# EAGLE design Bat_Node (EAGLE 9.6.0)
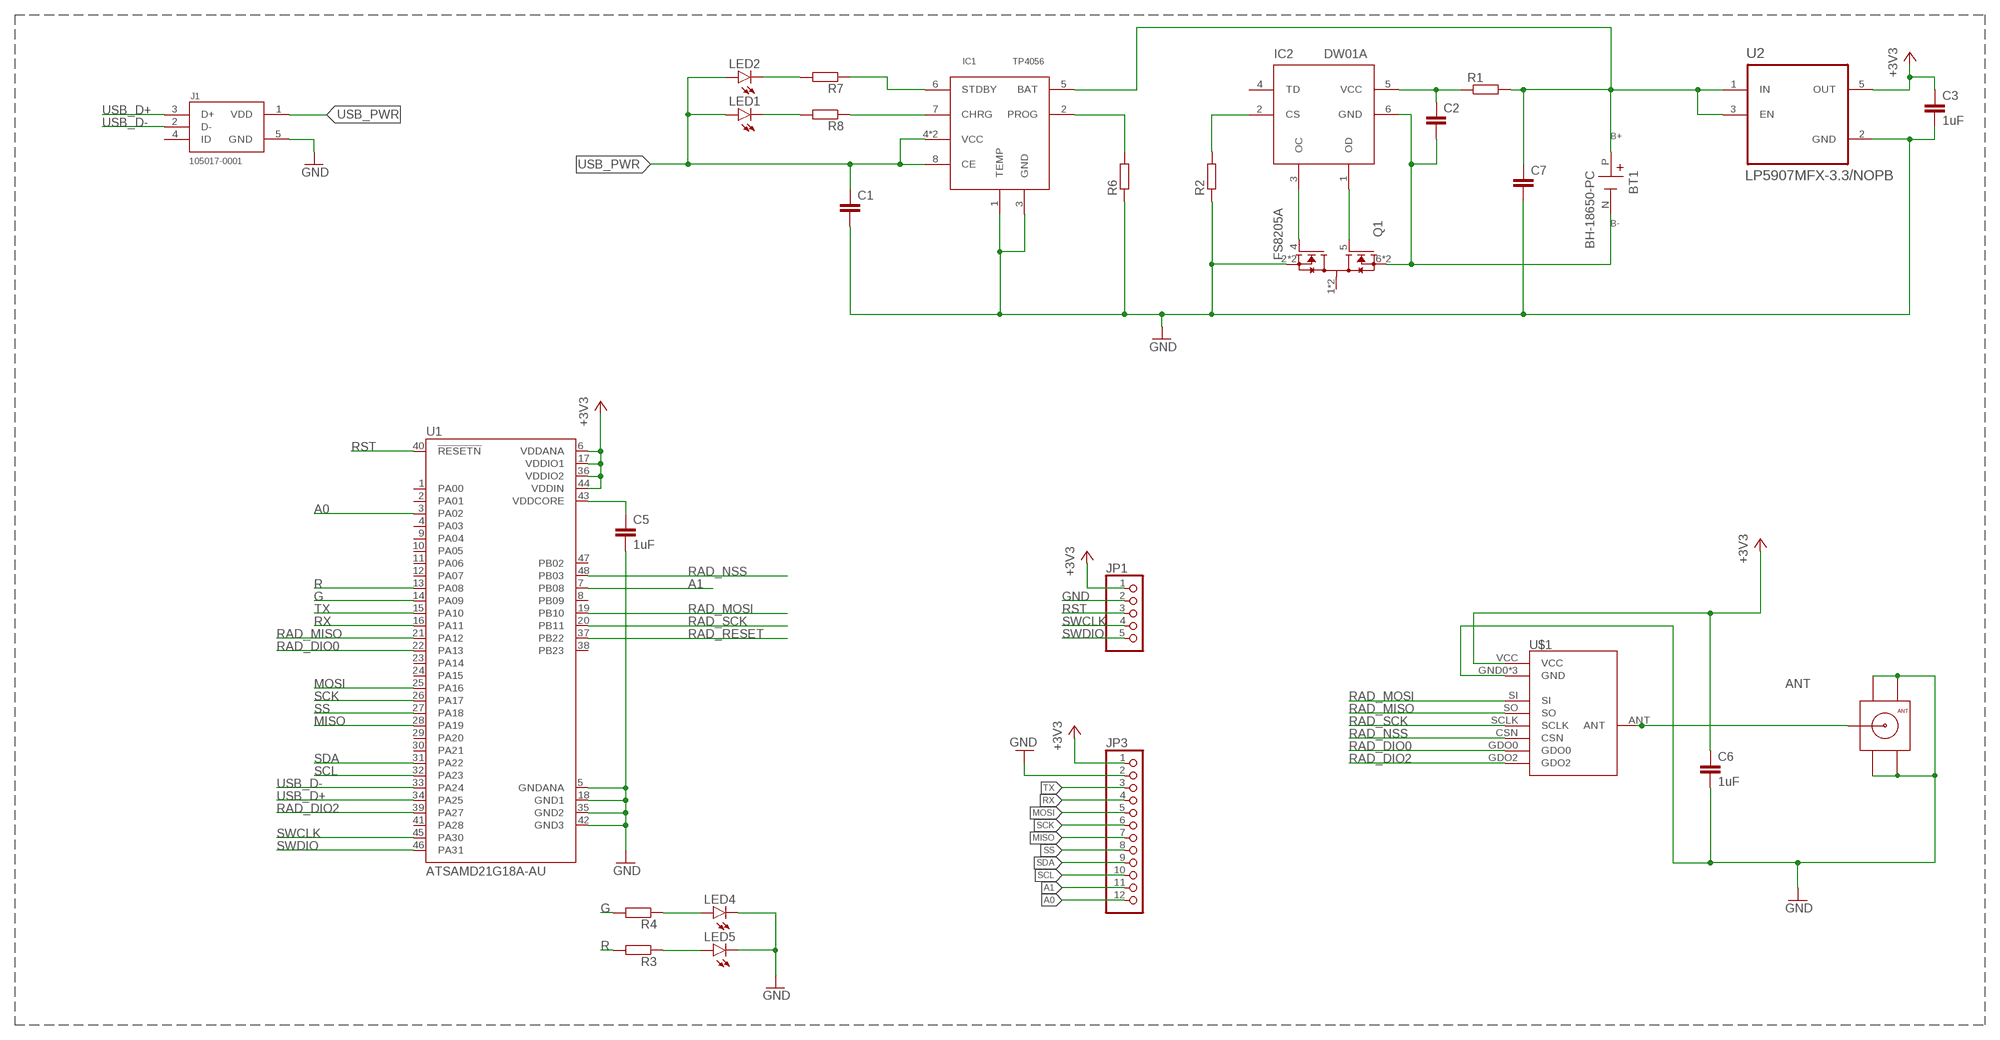
[diagram p0: schematic, sheet 1]

## Parts
BT1  BH-18650-PC  [BAT_BH-18650-PC]
C1  C-EUC0603  [C0603]
C2  C-EUC0603  [C0603]
C3  1uF  CC0603  [C0603]
C5  1uF  CC0603  [C0603]
C6  1uF  CC0603  [C0603]
C7  C-EUC0603  [C0603]
IC1  TP4056  [SOP-8]
IC2  DW01A  [SOT23-6]
J1  105017-0001  [MOLEX_105017-0001]
JP1  PINHD-1X5  [1X05]
JP3  PINHD-1X12  [1X12]
LED1  LEDCHIP-LED0603  [CHIP-LED0603]
LED2  LEDCHIP-LED0603  [CHIP-LED0603]
LED4  LEDCHIP-LED0603  [CHIP-LED0603]
LED5  LEDCHIP-LED0603  [CHIP-LED0603]
Q1  FS8205A  [SOP65P640X120-8N]
R1  R-EU_R0603  [R0603]
R2  R-EU_R0603  [R0603]
R3  RR0603  [R0603]
R4  RR0603  [R0603]
R6  R-EU_R0603  [R0603]
R7  R-EU_R0603  [R0603]
R8  R-EU_R0603  [R0603]
U1  ATSAMD21G18A-AU  [QFP50P900X900X120-48N]
U2  LP5907MFX-3.3/NOPB  [SOT95P280X145-5N]
U$1  CC1101SMD  [CC1101-SMD]
U$6  CON-SMA-EDGE-S  [CON-SMA-EDGE-S]

## Nets
+3V3: C3.1 C6.1 JP1.1 JP3.1 U1.6(VDDANA) U1.17(VDDIO1) U1.36(VDDIO2) U1.44(VDDIN) U2.5(OUT) U$1.VCC
A0: JP3.12 U1.3(PA02)
A1: JP3.11 U1.7(PB08)
ANT: U$1.ANT U$6.P$3(SIG)
B+: BT1.P(+) C7.1 IC1.5(BAT) R1.2 U2.1(IN) U2.3(EN)
B-: BT1.N(-) C2.2 IC2.6(GND) Q1.6(S2) Q1.7(S2)
G: R4.2 U1.14(PA09)
GND: C1.2 C3.2 C5.2 C6.2 C7.2 IC1.1(TEMP) IC1.3(GND) J1.5(GND) JP1.2 JP3.2 LED4.C LED5.C Q1.2(S1) Q1.3(S1) R2.1 R6.1 U1.5(GNDANA) U1.18(GND1) U1.35(GND2) U1.42(GND3) U2.2(GND) U$1.GND0(GND) U$1.GND1(GND) U$1.GND2(GND) U$6.P$1(GND) U$6.P$2(GND2) U$6.P$4(GND4) U$6.P$5(GND3)
MISO: JP3.7 U1.28(PA19)
MOSI: JP3.5 U1.25(PA16)
N$1: IC2.2(CS) R2.2
N$3: IC2.3(OC) Q1.4(G1)
N$4: IC2.1(OD) Q1.5(G2)
N$7: C2.1 IC2.5(VCC) R1.1
N$8: C5.1 U1.43(VDDCORE)
N$11: IC1.2(PROG) R6.2
N$12: LED5.A R3.1
N$13: LED4.A R4.1
N$19: IC1.7(CHRG) R8.1
N$20: IC1.6(STDBY) R7.1
N$21: LED2.C R7.2
N$22: LED1.C R8.2
R: R3.2 U1.13(PA08)
RAD_DIO0: U1.22(PA13) U$1.GDO0
RAD_DIO2: U1.39(PA27) U$1.GDO2
RAD_MISO: U1.21(PA12) U$1.SO
RAD_MOSI: U1.19(PB10) U$1.SI
RAD_NSS: U1.48(PB03) U$1.CSN
RAD_RESET: U1.37(PB22)
RAD_SCK: U1.20(PB11) U$1.SCLK
RST: JP1.3 U1.40(!RESETN)
RX: JP3.4 U1.16(PA11)
SCK: JP3.6 U1.26(PA17)
SCL: JP3.10 U1.32(PA23)
SDA: JP3.9 U1.31(PA22)
SS: JP3.8 U1.27(PA18)
SWCLK: JP1.4 U1.45(PA30)
SWDIO: JP1.5 U1.46(PA31)
TX: JP3.3 U1.15(PA10)
USB_D+: J1.3(D+) U1.34(PA25)
USB_D-: J1.2(D-) U1.33(PA24)
USB_PWR: C1.1 IC1.4(VCC) IC1.8(CE) IC1.PAD(VCC) J1.1(VDD) LED1.A LED2.A
Unconnected: IC2.4(TD) J1.4(ID) Q1.1(D12) Q1.8(D12) U1.1(PA00) U1.2(PA01) U1.4(PA03) U1.8(PB09) U1.9(PA04) U1.10(PA05) U1.11(PA06) U1.12(PA07) U1.23(PA14) U1.24(PA15) U1.29(PA20) U1.30(PA21) U1.38(PB23) U1.41(PA28) U1.47(PB02)

## Library data of the parts
BT1 = Bat_Node:BH-18650-PC; AVAILABILITY: Unavailable; DESCRIPTION: BATTERY HOLDER 18650 PC PIN; MF: MPD; MP: BH-18650-PC; PACKAGE: None; PRICE: None
C1 C2 C7 = rcl:C-EU: CAPACITOR, European symbol; SPICEPREFIX: C
C3 C5 C6 = eagle-ltspice:C: CAPACITOR, European symbol; SPICEMODEL: NONE; SPICEPREFIX: C
IC1 = Bat_Node:TP4056; AVAILABILITY: Unavailable; DESCRIPTION: Complete single cell Li-Ion battery with a constant current / constant voltage linear charger; MF: NanJing Top Power ASIC Corp.; MP: TP4056; PACKAGE: Package Analog Devices; PRICE: None
IC2 = Bat_Node:DW01A; AVAILABILITY: Unavailable; DESCRIPTION: Pushbutton Switch SPST-NC Standard Panel Mount, Front; MF: Fortune Semiconductor; MP: DW01A; PACKAGE: Package Analog Devices; PRICE: None
J1 = 105017-0001:105017-0001; AVAILABILITY: Unavailable; DESCRIPTION: Conn USB Type B M 5 POS 0.65mm Solder RA Thru-Hole 5 Terminal 1 Port Embossed T/R; MF: Molex; MP: 105017-0001; PACKAGE: None; PRICE: None
JP1 = pinhead:PINHD-1X5: PIN HEADER
JP3 = pinhead:PINHD-1X12: PIN HEADER
LED1 LED2 LED4 LED5 = led:LED: LED OSRAM: - CHIPLED LG R971, LG N971, LY N971, LG Q971, LY Q971, LO R971, LY R971 LH N974, LH R974 LS Q976, LO Q976, LY Q976 LO Q996 - Hyper CHIPLED LW Q18S LB Q993, LB Q99A, LB R99A - SideLED LS A670, LO A670, LY A670, LG A670, LP A670 LB A673, LV A673, LT A673, LW A673 LH A674 LY A675 LS A676, LA A676, LO A676, LY A676, LW A676 LS A679, LY A679, LG A679 - Hyper Micro SIDELED® LS Y876, LA Y876, LO Y876, LY Y876 LT Y87S - SmartLED LW L88C, LW L88S LB L89C, LB L89S, LG L890 LS L89K, LO L89K, LY L89K LS L896, LA L896, LO L896, LY L896 - TOPLED LS T670, LO T670, LY T670, LG T670, LP T670 LSG T670, LSP T670, LSY T670, LOP T670, LYG T670 LG T671, LOG T671, LSG T671 LB T673, LV T673, LT T673, LW T673 LH T674 LS T676, LA T676, LO T676, LY T676, LB T676, LH T676, LSB T676, LW T676 LB T67C, LV T67C, LT T67C, LS T67K, LO T67K, LY T67K, LW E67C LS E67B, LA E67B, LO E67B, LY E67B, LB E67C, LV E67C, LT E67C LW T67C LS T679, LY T679, LG T679 LS T770, LO T770, LY T770, LG T770, LP T770 LB T773, LV T773, LT T773, LW T773 LH T774 LS E675, LA E675, LY E675, LS T675 LS T776, LA T776, LO T776, LY T776, LB T776 LHGB T686 LT T68C, LB T68C - Hyper Mini TOPLED® LB M676 - Mini TOPLED Santana® LG M470 LS M47K, LO M47K, LY M47K Source: http://www.osram.convergy.de LUXEON: - LUMILED® LXK2-PW12-R00, LXK2-PW12-S00, LXK2-PW14-U00, LXK2-PW14-V00 LXK2-PM12-R00, LXK2-PM12-S00, LXK2-PM14-U00 LXK2-PE12-Q00, LXK2-PE12-R00, LXK2-PE12-S00, LXK2-PE14-T00, LXK2-PE14-U00 LXK2-PB12-K00, LXK2-PB12-L00, LXK2-PB12-M00, LXK2-PB14-N00, LXK2-PB14-P00, LXK2-PB14-Q00 LXK2-PR12-L00, LXK2-PR12-M00, LXK2-PR14-Q00, LXK2-PR14-R00 LXK2-PD12-Q00, LXK2-PD12-R00, LXK2-PD12-S00 LXK2-PH12-R00, LXK2-PH12-S00 LXK2-PL12-P00, LXK2-PL12-Q00, LXK2-PL12-R00 Source: www.luxeon.com KINGBRIGHT: KA-3528ASYC Source: www.kingbright.com
Q1 = Bat_Node:FS8205A: N/A; AVAILABILITY: Unavailable; MF: Fortune Semiconductor; MP: FS8205A; PACKAGE: Package Analog Devices; PRICE: None
R1 R2 R6-R8 = rcl:R-EU_: RESISTOR, European symbol; SPICEPREFIX: R
R3 R4 = eagle-ltspice:R: RESISTOR, European symbol; SPICEMODEL: NONE; SPICEPREFIX: R
U1 = ATSAMD21G18A-AU:ATSAMD21G18A-AU: Cortex-M0+, 256KB FLASH, 32KB SRAM, USB, DMA, T&R - 48TQFP IND TEMP, GREEN, 1.6-3.6V, 48MHz; AVAILABILITY: Good; DESCRIPTION: SAMD21G Series 256 kB Flash 32 kB SRAM 48 MHz 32-Bit Microcontroller - TQFP-48; MF: Microchip; MP: ATSAMD21G18A-AU; PACKAGE: TQFP-48 Microchip; PRICE: 3.06 USD
U2 = Bat_Node:LP5907MFX-3.3/NOPB: IC REG LINEAR 3.3V 250MA SOT23; AVAILABILITY: Unavailable; DESCRIPTION: Linear Voltage Regulator IC 1 Output 250mA SOT-23-5; MF: Texas Instruments; MP: LP5907MFX-3.3/NOPB; PACKAGE: SOT-23 Texas Instruments; PRICE: None
U$1 = modules:CC1101
U$6 = internship19:CON-SMA-EDGE-S

## Board
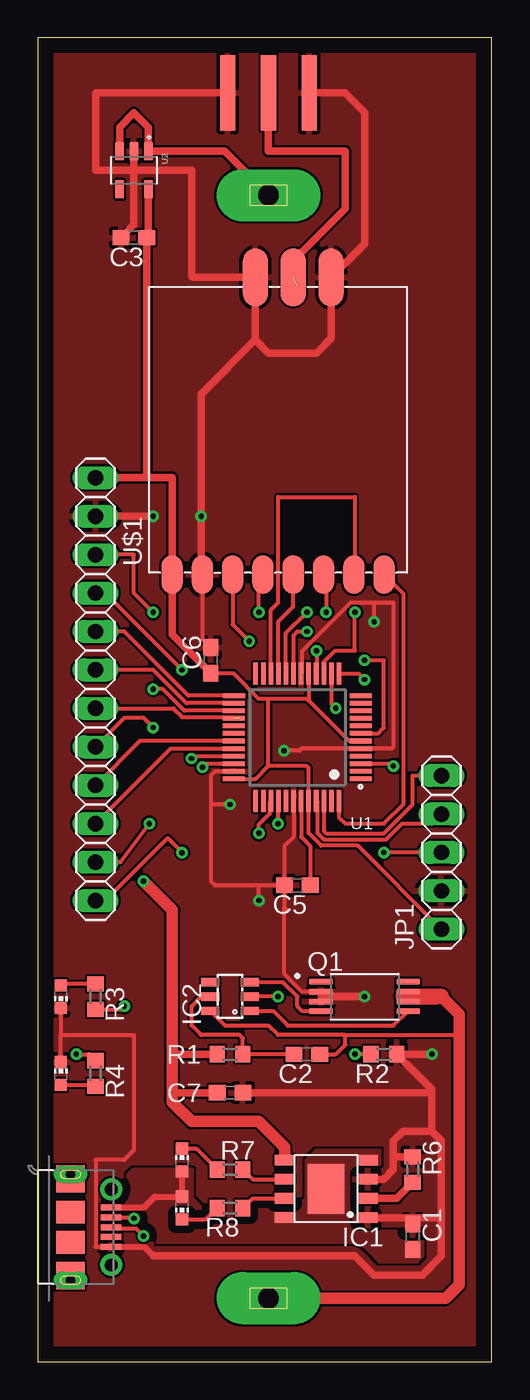
[diagram p1: board, top side]
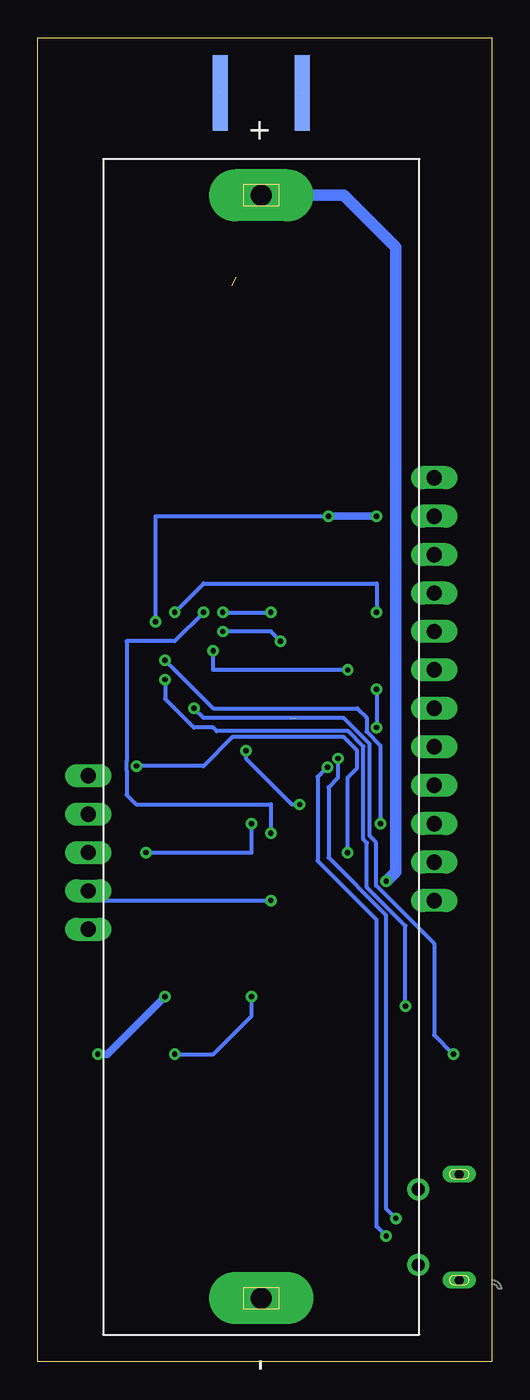
[diagram p2: board, bottom side, seen from below]

Size 30 x 87.5 mm. Coordinates in mm from the lower left corner, seen from the top.
Outline: 0,0 30,0 30,87.5 0,87.5 0,0
Copper layers (1*16): Top 0.035mm / dielectric 1.5mm / Bottom 0.035mm
Design rules "default": minimum track width 6mil, minimum drill 0.35mm, track to track 6mil, track to pad 6mil, pad to pad 6mil, via to via 6mil, smd to smd 6mil, copper to edge 40mil, drill to drill 6mil, minimum pad ring 10mil, minimum via ring 8mil, stop-mask expansion 4mil, vias tented up to drill 0mil, thermal gap 10mil

### Footprints (pad centres in the part's own frame; a part is rotated, then mirrored left to right if it is on the bottom)
BAT_BH-18650-PC = drill 1.38 pad 3.44 long: N -36.45,0; P 36.45,0
C0603 = smd 1.1 x 1: 1 -0.85,0; 2 0.85,0
SOP-8 = smd 1.3 x 0.7: 1 -2.75,1.905; 2 -2.75,0.635; 3 -2.75,-0.635; 4 -2.75,-1.905; 5 2.75,-1.905; 6 2.75,-0.635; 7 2.75,0.635; 8 2.75,1.905 | smd 2.413 x 3.302: PAD 0,0
SOT23-6 = smd 0.55 x 1.2: 1 -0.95,-1.3; 2 0,-1.3; 3 0.95,-1.3; 4 0.95,1.3; 5 0,1.3; 6 -0.95,1.3
MOLEX_105017-0001 = smd 0.4 x 1.35: 1 -1.3,2.675; 2 -0.65,2.675; 3 0,2.675; 4 0.65,2.675; 5 1.3,2.675 | drill 0.85 pad 1.45: P$1 -2.5,2.7; P$2 2.5,2.7 | smd 1.5 x 1.9: P$8 -1,0; P$9 1,0 | smd 1.8 x 1.9: P$10 -3.2,0; P$11 3.2,0 | drill 0.6 pad 0.8 long: P$12 -3.5,0; P$13 3.5,0
1X05 = drill 1.016 long: 1 -5.08,0; 2 -2.54,0; 3 0,0; 4 2.54,0; 5 5.08,0
1X12 = drill 1.016 long: 1 -13.97,0; 2 -11.43,0; 3 -8.89,0; 4 -6.35,0; 5 -3.81,0; 6 -1.27,0; 7 1.27,0; 8 3.81,0; 9 6.35,0; 10 8.89,0; 11 11.43,0; 12 13.97,0
CHIP-LED0603 = smd 0.8 x 0.8: A 0,-0.75; C 0,0.75
SOP65P640X120-8N = smd 1.56 x 0.4: 1 -2.88,0.975; 2 -2.88,0.325; 3 -2.88,-0.325; 4 -2.88,-0.975; 5 2.88,-0.975; 6 2.88,-0.325; 7 2.88,0.325; 8 2.88,0.975
R0603 = smd 1 x 1.1: 1 -0.85,0; 2 0.85,0
QFP50P900X900X120-48N = smd 1.45 x 0.3: 1 -4.2,2.75; 2 -4.2,2.25; 3 -4.2,1.75; 4 -4.2,1.25; 5 -4.2,0.75; 6 -4.2,0.25; 7 -4.2,-0.25; 8 -4.2,-0.75; 9 -4.2,-1.25; 10 -4.2,-1.75; 11 -4.2,-2.25; 12 -4.2,-2.75; 25 4.17,-2.75; 26 4.2,-2.25; 27 4.2,-1.75; 28 4.2,-1.25; 29 4.2,-0.75; 30 4.2,-0.25; 31 4.2,0.25; 32 4.2,0.75; 33 4.2,1.25; 34 4.2,1.75; 35 4.2,2.25; 36 4.2,2.75 | smd 0.3 x 1.45: 13 -2.75,-4.2; 14 -2.25,-4.2; 15 -1.75,-4.2; 16 -1.25,-4.2; 17 -0.75,-4.2; 18 -0.25,-4.2; 19 0.25,-4.2; 20 0.75,-4.2; 21 1.25,-4.2; 22 1.75,-4.2; 23 2.25,-4.2; 24 2.75,-4.2; 37 2.75,4.2; 38 2.25,4.2; 39 1.75,4.2; 40 1.25,4.2; 41 0.75,4.2; 42 0.25,4.2; 43 -0.25,4.2; 44 -0.75,4.2; 45 -1.25,4.2; 46 -1.75,4.2; 47 -2.25,4.2; 48 -2.75,4.2
SOT95P280X145-5N = smd 1.21 x 0.59: 1 -1.255,0.95; 2 -1.255,0; 3 -1.255,-0.95; 4 1.255,-0.95; 5 1.255,0.95
CC1101-SMD = smd 3.81 x 1.65: ANT 10.075,-1; GND1 10.075,-3.5; GND2 10.075,1.5 | smd 2.54 x 1.4: CSN -9.565,-7; GDO0 -9.565,-5; GDO2 -9.565,-3; GND0 -9.565,5; SCLK -9.565,1; SI -9.565,3; SO -9.565,-1; VCC -9.565,7
CON-SMA-EDGE-S = smd 5 x 1: P$1 2.5,2.7; P$2 2.5,-2.7; P$3 2.5,0 | smd 5 x 1 bottom: P$4 2.5,2.7; P$5 2.5,-2.7

### Placement (x,y rotation side)
BT1  15.24,40.64 90 bottom
C1  24.77,8.26 90 top
C2  17.78,20.32 0 top
C3  6.35,74.3 180 top
C5  17.14,31.5 180 top
C6  11.43,46.35 90 top
C7  12.7,17.78 0 top
IC1  19.05,11.43 180 top
IC2  12.7,24.13 90 top
J1  2.16,8.89 270 top
JP1  26.67,33.66 90 top
JP3  3.81,44.45 270 top
LED1  9.53,10.16 180 top
LED2  9.53,13.34 0 top
LED4  1.52,19.05 0 top
LED5  1.52,24.13 180 top
Q1  21.59,24.13 0 top
R1  12.7,20.32 180 top
R2  22.86,20.32 180 top
R3  3.81,24.13 270 top
R4  3.81,19.05 90 top
R6  24.77,12.7 270 top
R7  12.7,12.7 180 top
R8  12.7,10.16 180 top
U1  17.14,41.27 180 top
U2  6.35,78.74 270 top
U$1  15.88,61.59 90 top
U$6  15.24,86.36 270 top

### Tracks (layer width: path | path; a pad name or v marks a point on that pad's centre or on a via)
+3V3
  Top 0.254: C6.1 12.91,45.51 14.61,43.81 15.24,43.81 | 15.24,43.81 17.78,43.81 17.89,43.7 | U1.6 20.57,41.02 19.05,42.55 | 19.05,42.55 17.89,43.7 | U1.36 14.39,38.52 15.24,39.37 | 15.24,39.37 15.24,43.81 | 15.24,39.37 17.78,39.37 17.89,39.26 17.89,37.47 U1.44 17.89,34.93 18.71,34.11 21.13,34.11 JP1.1 | U1.17 17.89,43.7 | U$1.VCC 8.88,51.44 | 19.05,42.55
  Top 0.508: U2.5 7.3,74.39 C3.1 7.2,58.63 6.99,58.42 | JP3.1 6.99,58.42 | 6.99,58.42 8.89,58.42 8.89,51.45 8.88,51.44 | U$1.VCC 8.89,52.02 8.89,48.05 C6.1
A0  (via drill 0.35)
  Top 0.254: JP3.12 4.45,30.48 8.57,34.61 v9.53,33.65 | U1.3 23.33,39.52 v23.49,39.37
  Bottom 0.254: v9.53,33.65 9.53,35.91 | 9.53,35.91 9.55,35.92 | v23.5,39.37 v23.49,39.37 19.05,39.37 17.14,41.27 9.78,41.27 8.9,40.39 8.9,39.23 9.53,38.6 9.53,35.91
A1  (via drill 0.35)
  Top 0.254: U1.7 22.48,41.52 22.86,41.91 22.86,46.35 v21.59,46.35 | v7.37,35.56 5.46,33.02 JP3.11
  Bottom 0.254: v21.59,46.35 18.41,43.18 8.89,43.18 8.28,42.57 8.28,41.64 7.37,40.73 v7.37,35.56
ANT  (1 unrouted)
  Top 0.508: U$6.P$3 15.24,80.01 20.32,80.01 20.32,76.2 17.14,73.03 17.14,71.12
B+  (via drill 0.35)
  Top 0.508: C7.1 8.89,17.78 | R1.2 8.89,20.32 | BT1.P 12.34,80 U2.1 7.3,81.6 6.35,82.55 5.4,81.6 U2.3
  Top 0.762: IC1.5 16.3,14.18 14.61,15.88 10.16,15.88 8.89,17.14 8.89,17.78 8.89,20.32 8.89,29.84 v6.99,31.75
  Bottom 0.762: v6.99,31.75 6.35,32.38 6.35,73.66 9.78,77.09 BT1.P
B-
  Top 0.254: IC2.6 12.36,22.23 15.24,22.23 15.88,21.59 20.32,21.59 | C2.2 19.68,20.32 20.32,20.95 20.32,21.59 | 20.32,21.59 27.84,21.59
  Top 0.381: Q1.7 26.34,24.45 26.67,24.13 26.34,23.8 Q1.6
  Top 0.762: BT1.N 26.95,4.19 27.84,5.08 27.84,21.59 27.84,22.96 26.67,24.13
  Top 1.016: 26.67,24.13 24.13,24.13
G  (via drill 0.35)
  Top 0.254: U1.14 19.39,43.47 v19.68,43.18 | v2.54,20.32 3.39,20.32 R4.2
  Bottom 0.254: v19.68,43.18 19.05,42.55 9.79,42.55 8.09,40.84 8.09,34.76 7.64,34.31 7.64,31.48 3.81,27.64 3.81,21.59 v2.54,20.32
GND  (via drill 0.35)  (2 unrouted)
  Top 0.254: C5.2 16.3,34.08 16.89,34.67 U1.42 16.89,37.22 16.97,37.29 16.97,37.47 | C5.2 16.3,30.06 | 16.3,30.06 16.51,29.84 | 16.3,30.06 16.3,25.61 17.45,24.45 Q1.2 18.71,24.13 Q1.3 | U$1.GND0 10.88,51.44 10.88,47.76 C6.2 | U1.18 17.47,45.55 17.47,46.97 20.68,50.19 22.23,50.19 | 22.23,50.19 23.47,50.19 23.5,50.16 23.5,40.64 23.38,40.52 U1.5 17.41,40.52 17.27,40.39 v16.26,40.39 | v22.23,48.9 22.23,50.19 | U1.35 11.72,39.02 11.43,38.73 11.43,36.83 | 11.43,36.83 11.43,31.75 11.68,31.5 14.61,31.5 | 14.61,31.5 C5.2 | v12.7,36.83 11.43,36.83 | v14.61,30.48 14.61,31.5 | LED4.C 1.52,21.59 | LED5.C 1.52,21.59 | 1.52,21.59 6.35,21.59 6.35,13.97 5.71,13.34 3.81,13.34 3.81,7.62 3.84,7.59 5.08,7.59
  Top 0.381: J1.5 5.08,7.59 7.01,7.59 7.62,6.99
  Top 0.508: IC1.3 22.86,12.06 23.5,12.7 23.5,13.34 | 23.5,13.34 23.5,14.61 24.13,15.24 26.04,15.24 | R6.1 23.71,13.55 23.5,13.34 | IC1.1 24.77,9.53 | C1.2 24.77,9.53 | 24.77,9.53 26.67,9.53 | 14.38,67.54 U$1.GND2 10.24,71.67 10.16,71.75 10.16,78.74 6.35,78.74 | 14.38,67.54 15.24,66.67 18.41,66.67 19.38,67.64 U$1.GND1 21.59,73.89 21.59,82.55 20.28,83.86 U$6.P$4 | U2.2 6.35,78.74 | 6.35,78.74 6.35,75.14 C3.2 | 6.35,78.74 3.81,78.74 3.81,83.82 3.85,83.86 U$6.P$5 | JP3.2 v7.62,55.88 | 10.88,51.44 10.79,51.52 v10.79,55.88 10.79,63.96 14.38,67.54 | 26.04,18 R2.1 v26.04,20.32 | 26.04,18 26.04,15.24 | C7.2 25.82,17.78 26.04,18 | 26.04,15.24 26.67,14.61 26.67,9.53 | v21.59,24.13 18.71,24.13 | 26.67,9.53 26.67,6.99 25.4,5.71 22.23,5.71 20.95,6.99 7.62,6.99
  Bottom 0.254: v10.79,55.88 22.23,55.88 v22.23,48.9 | v16.26,40.39 16.26,39.88 13.21,36.83 v12.7,36.83 | JP1.2 26.04,30.48 v14.61,30.48
  Bottom 0.508: v7.62,55.88 v10.79,55.88 | v26.04,20.32 25.4,20.32 v21.59,24.13
  pour Top (rank 2): 1.91,0 0,1.91 0,85.72 1.91,87.63 28.57,87.63 29.84,86.36 29.84,1.91 27.94,0
MISO  (1 unrouted)
  Top 0.254: 12.93,42.55 U1.28 | JP3.7 8.95,43.18 9.54,42.6 13.28,42.6 13.34,42.55
MOSI
  Top 0.254: U1.25 9.95,44.02 5.71,48.26 JP3.5
N$1  (via drill 0.35)
  Top 0.254: R2.2 v20.95,20.32 | v15.88,24.13 IC2.2
  Bottom 0.254: v20.95,20.32 18.41,20.32 15.88,22.86 v15.88,24.13
N$3
  Top 0.254: Q1.4 17.48,23.16 17.14,23.5 17.14,24.13 16.2,25.08 IC2.3
N$4
  Top 0.254: IC2.1 15.55,23.18 16.51,22.23 23.5,22.23 24.43,23.16 Q1.5
N$7
  Top 0.254: C2.1 R1.1 13.55,21.38 13.34,21.59 10.79,21.59 10.16,22.23 10.16,23.5 10.79,24.13 IC2.5
N$8
  Top 0.254: U1.43 17.39,34.67 18,34.08 C5.1
N$11
  Top 0.508: R6.2 23.71,10.79 IC1.2
N$12
  Top 0.254: R3.1 1.62,24.98 LED5.A
N$13
  Top 0.254: LED4.A 3.71,18.3 R4.1
N$19
  Top 0.254: R8.1 14.19,10.79 IC1.7
N$20
  Top 0.254: R7.1 14.19,12.06 IC1.6
N$21
  Top 0.254: LED2.C 10.46,14.09 R7.2
N$22
  Top 0.254: LED1.C 11.1,9.41 R8.2
R  (via drill 0.35)
  Top 0.254: U1.13 21.2,45.48 v21.59,45.09 | R3.2 5.5,23.28 v5.71,23.5
  Bottom 0.254: v21.59,45.09 21.59,43.81 19.68,41.91 18.41,41.91 18.19,41.68 9.51,41.68 8.49,40.67 8.49,34.53 8.26,34.29 8.26,31.35 5.71,28.81 v5.71,23.5
RAD_DIO0
  Top 0.254: U1.22 15.39,49.69 15.88,50.16 15.88,57.15 20.95,57.15 20.95,52.11 U$1.GDO0
RAD_DIO2  (via drill 0.35)
  Top 0.254: U$1.GDO2 19.05,51.85 v19.05,49.53 | U1.39 15.32,37 15.32,36.23 14.61,35.52 v14.61,34.92
  Bottom 0.254: v19.05,49.53 20.95,47.62 24.13,47.62 24.13,39.66 24.14,39.64 24.14,39.1 24.13,39.08 24.13,37.47 23.5,36.83 14.61,36.83 v14.61,34.92
RAD_MISO
  Top 0.254: U1.21 15.89,48.91 16.88,49.9 U$1.SO
RAD_MOSI  (via drill 0.35)
  Top 0.254: U$1.SI 12.88,48.72 v13.97,47.62 | U1.19 16.89,48.01 17.14,48.26 v17.78,48.26
  Bottom 0.254: v13.97,47.62 14.61,48.26 v17.78,48.26
RAD_NSS
  Top 0.254: U$1.CSN 24.14,50.76 24.14,36.84 22.86,35.56 20.32,35.56 19.89,35.98 U1.48
RAD_SCK  (via drill 0.35)
  Top 0.254: U1.20 16.39,48.15 v17.78,49.53 | v14.61,49.53 14.61,51.76 U$1.SCLK
  Bottom 0.254: v17.78,49.53 v14.61,49.53
RST  (via drill 0.35)
  Top 0.254: U1.40 15.88,37.05 v15.88,35.56 | JP1.3 v22.86,33.66
  Bottom 0.254: v22.86,33.66 15.88,33.66 v15.88,35.56
RX  (via drill 0.35)
  Top 0.254: JP3.4 4.45,50.8 v9.53,45.72 | v18.41,46.99 18.41,45.49 U1.16
  Bottom 0.254: v9.53,45.72 18.41,45.72 v18.41,46.99
SCK
  Top 0.254: U1.26 9.81,43.52 7.62,45.72 JP3.6
SCL
  Top 0.254: JP3.10 8.78,40.52 U1.32
SDA
  Top 0.254: U1.31 6.74,41.02 JP3.9
SS  (via drill 0.35)
  Top 0.254: U1.27 9.68,43.02 8.26,44.45 v7.62,44.45 | JP3.8 5.71,42.55 6.99,42.55 v7.62,41.91
  Bottom 0.254: v7.62,44.45 v7.62,41.91
SWCLK
  Top 0.254: JP1.4 26.04,35.56 24.07,35.56 23.03,34.52 18.88,34.52 18.47,34.94 18.47,37 U1.45
SWDIO
  Top 0.254: U1.46 18.89,35.08 19.05,34.92 22.86,34.92 24.77,36.83 24.77,38.73 JP1.5
TX  (via drill 0.35)
  Top 0.254: U1.15 18.89,46.24 19.64,46.99 20.95,46.99 v20.95,49.53 | v7.62,49.53 6.35,50.8 6.35,53.34 JP3.3
  Bottom 0.254: v7.62,49.53 7.62,51.44 19.05,51.44 v20.95,49.53
USB_D+  (via drill 0.35)
  Top 0.254: J1.3 5.36,8.89 5.44,8.81 6.49,8.81 v6.99,8.31 | v10.87,39.29 11.1,39.52 U1.34
  Bottom 0.254: v6.99,8.31 7.62,8.95 7.62,29.21 11.51,33.1 11.51,38.66 v10.87,39.29
USB_D-  (via drill 0.35)
  Top 0.254: J1.2 6.28,9.54 v6.35,9.47 | v10.16,39.87 10.32,40.02 U1.33
  Bottom 0.254: v6.35,9.47 6.99,10.1 6.99,29.5 10.79,33.31 10.79,37.96 10.16,38.6 v10.16,39.87
USB_PWR
  Top 0.381: J1.1 7.01,10.19 7.74,10.91 LED1.A LED2.A
  pour Top (isolate 0.508, no thermals): 10.16,12.7 10.16,10.79 10.79,10.16 17.14,10.16 17.78,10.79 17.78,13.34 18.41,13.97 24.77,13.97 25.4,13.34 25.4,6.99 24.77,6.35 22.86,6.35 21.59,7.62 4.45,7.62 4.45,10.79 6.35,12.7